# EAGLE design IOIO Sensors (EAGLE 5.11)
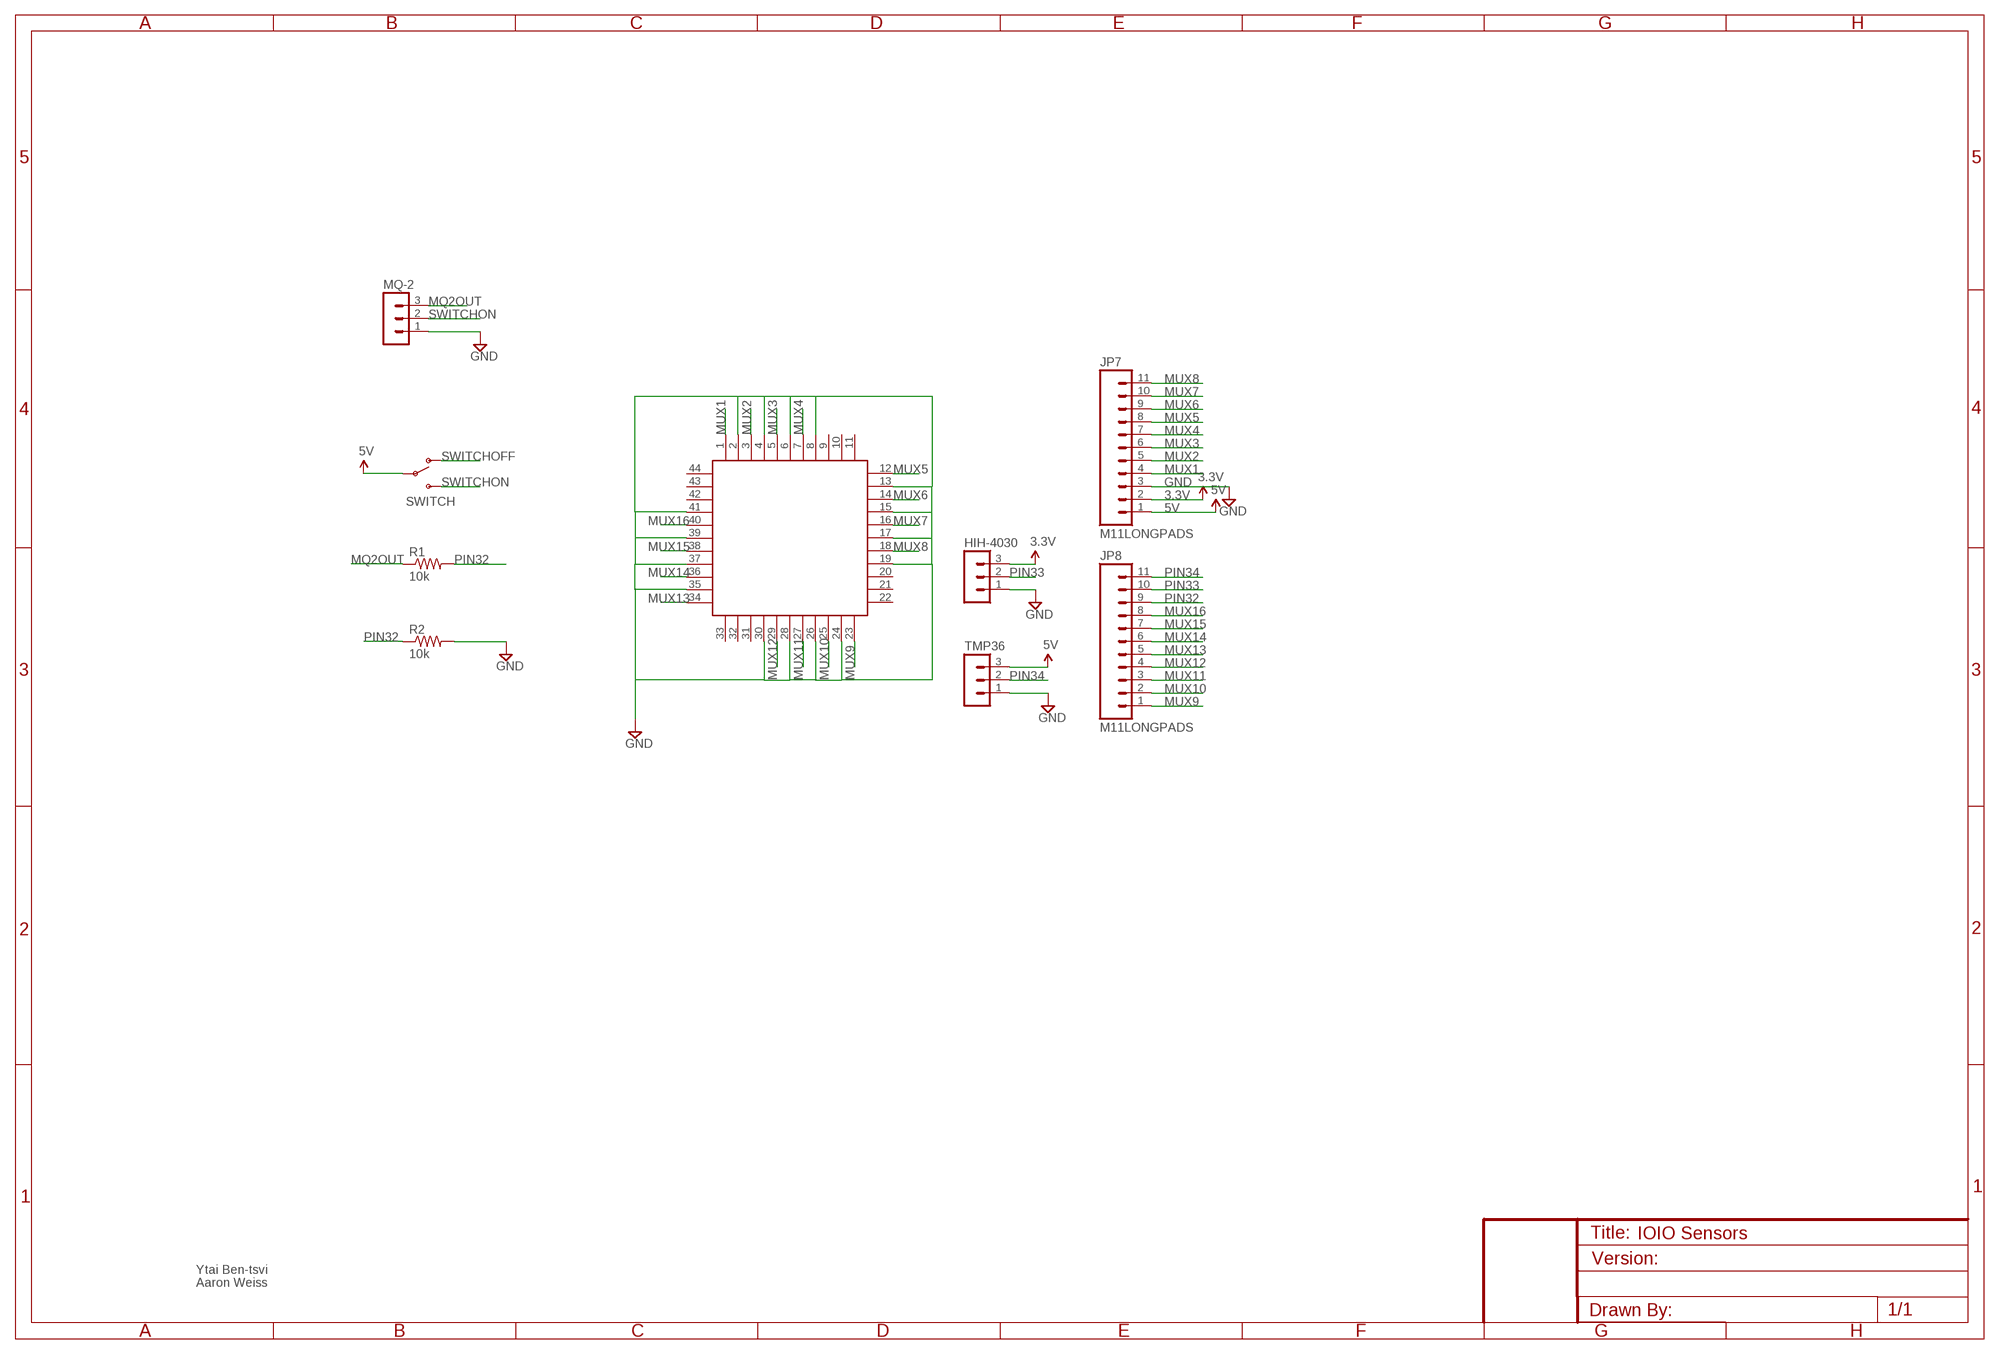
[diagram p0: schematic, sheet 1]

## Parts
HIH-4030  MA03-1  [MA03-1]
JP7  M11LONGPADS  [1X11_LONGPADS]
JP8  M11LONGPADS  [1X11_LONGPADS]
MQ-2  MA03-1  [MA03-1]
R1  10k  R-US_0207/7  [0207/7]
R2  10k  R-US_0207/7  [0207/7]
SWITCH  SWITCH-SPSTPTH_LOCK  [SWITCH-SPDT_LOCK.007S]
TMP36  MA03-1  [MA03-1]
U$4  S44  [S44]

## Nets
3.3V: HIH-4030.3 JP7.2
5V: JP7.1 SWITCH.2(P) TMP36.3
GND: HIH-4030.1 JP7.3 MQ-2.1 R2.2 TMP36.1 U$4.2 U$4.4 U$4.6 U$4.8 U$4.13 U$4.15 U$4.17 U$4.19 U$4.24 U$4.26 U$4.28 U$4.30 U$4.35 U$4.37 U$4.39 U$4.41
MQ2OUT: MQ-2.3 R1.1
MUX1: JP7.4 U$4.1
MUX2: JP7.5 U$4.3
MUX3: JP7.6 U$4.5
MUX4: JP7.7 U$4.7
MUX5: JP7.8 U$4.12
MUX6: JP7.9 U$4.14
MUX7: JP7.10 U$4.16
MUX8: JP7.11 U$4.18
MUX9: JP8.1 U$4.23
MUX10: JP8.2 U$4.25
MUX11: JP8.3 U$4.27
MUX12: JP8.4 U$4.29
MUX13: JP8.5 U$4.34
MUX14: JP8.6 U$4.36
MUX15: JP8.7 U$4.38
MUX16: JP8.8 U$4.40
PIN32: JP8.9 R1.2 R2.1
PIN33: HIH-4030.2 JP8.10
PIN34: JP8.11 TMP36.2
SWITCHOFF: SWITCH.1(O)
SWITCHON: MQ-2.2 SWITCH.3(S)
Unconnected: U$4.9 U$4.10 U$4.11 U$4.20 U$4.21 U$4.22 U$4.31 U$4.32 U$4.33 U$4.42 U$4.43 U$4.44

## Notes on the sheet
- Ytai Ben-tsvi
- Aaron Weiss

## Library data of the parts
HIH-4030 MQ-2 TMP36 = con-lstb:MA03-1: PIN HEADER; OC_FARNELL: unknown; OC_NEWARK: unknown
JP7 JP8 = SparkFun:M11: Header 11 Standard 11-pin 0.1" header. Use with straight break away headers (SKU : PRT-00116), right angle break away headers (PRT-00553), swiss pins (PRT-00743), machine pins (PRT-00117), and female headers (PRT-00115).
R1 R2 = resistor:R-US_: RESISTOR, American symbol
SWITCH = SparkFun:SWITCH-SPST: SPST Switch Simple slide switch. Spark Fun Electronics SKU : COM-00102
U$4 = plcc-socket:S44: 44-pin PLCC through-hole socket

## Board
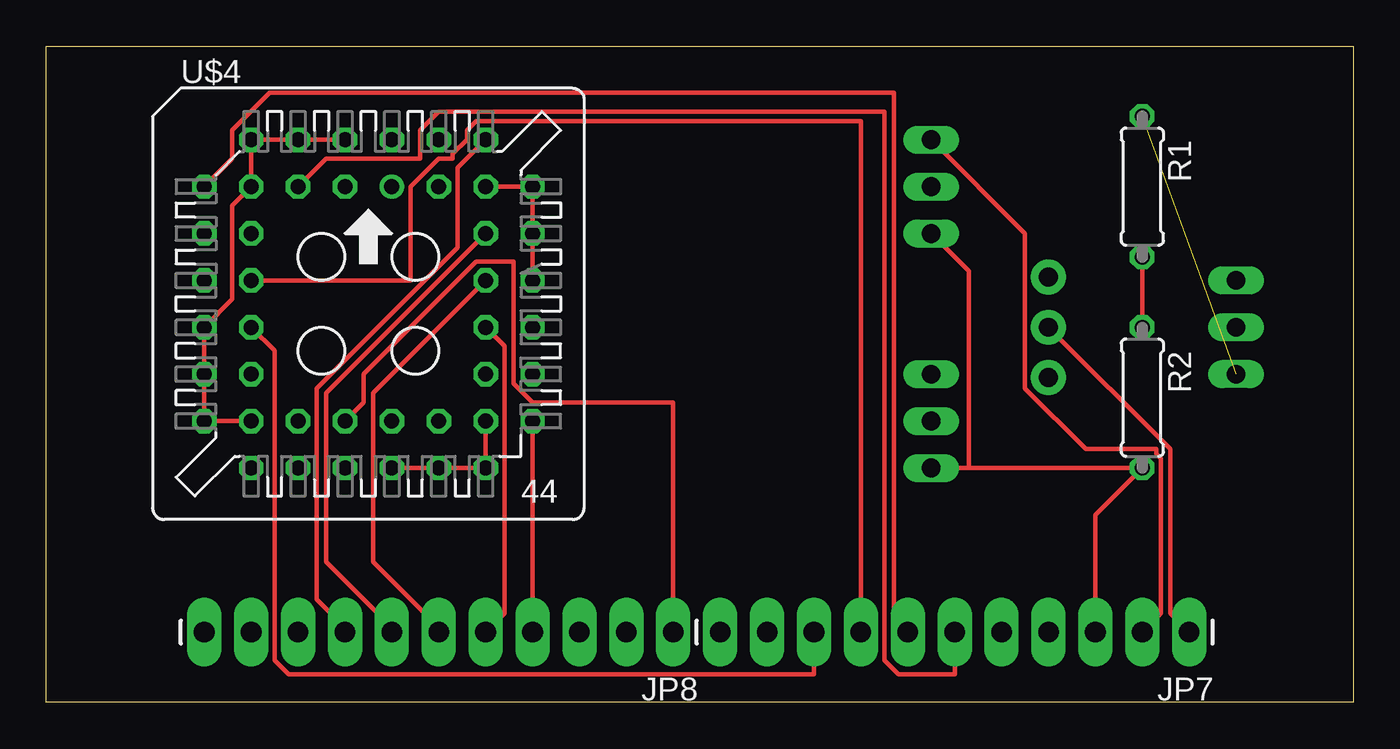
[diagram p1: board, top side]
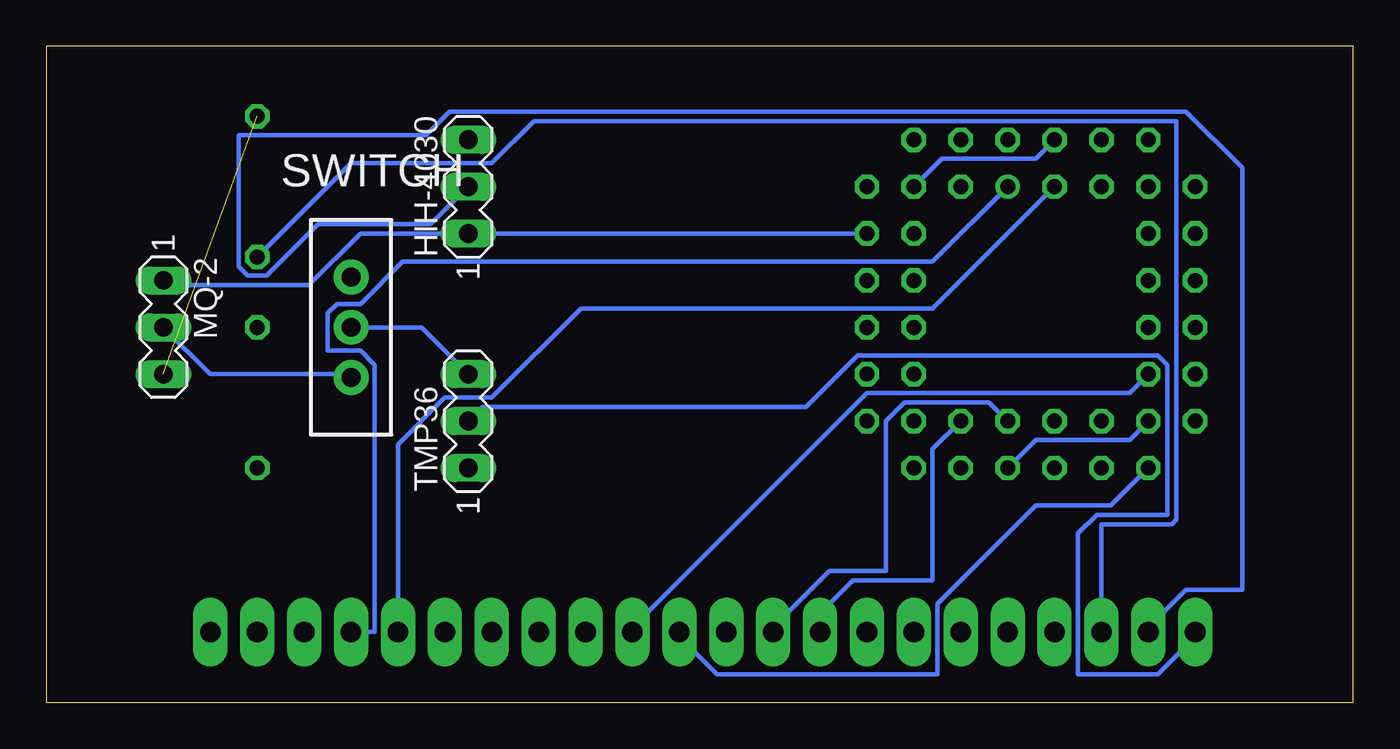
[diagram p2: board, bottom side, seen from below]

Size 70.79 x 35.55 mm. Coordinates in mm from the lower left corner, seen from the top.
Outline: 70.79,0 0,0 0,35.55 70.79,35.55 70.79,0
Copper layers (1*16): Top 0.035mm / dielectric 1.5mm / Bottom 0.035mm
Design rules "default": minimum track width 10mil, minimum drill 24mil, track to track 8mil, track to pad 8mil, pad to pad 8mil, via to via 8mil, smd to smd 8mil, copper to edge 40mil, drill to drill 8mil, minimum pad ring 10mil, minimum via ring 8mil, stop-mask expansion 4mil, vias tented up to drill 0mil, thermal gap 10mil

### Footprints (pad centres in the part's own frame; a part is rotated, then mirrored left to right if it is on the bottom)
MA03-1 = drill 1.016 long: 1 -2.54,0; 2 0,0; 3 2.54,0
1X11_LONGPADS = drill 1.118 pad 1.88 long: 1 0,0; 2 2.54,0; 3 5.08,0; 4 7.62,0; 5 10.16,0; 6 12.7,0; 7 15.24,0; 8 17.78,0; 9 20.32,0; 10 22.86,0; 11 25.4,0
0207/7 = drill 0.813 octagon: 1 -3.81,0; 2 3.81,0
SWITCH-SPDT_LOCK.007S = drill 1.016 pad 1.88 round: 1 0,2.718; 2 0,0; 3 0,-2.718
S44 = drill 0.813 round: 1 1.27,6.35 | drill 0.813 octagon: 2 -1.27,8.89; 3 -1.27,6.35; 4 -3.81,8.89; 5 -3.81,6.35; 6 -6.35,8.89; 7 -8.89,6.35; 8 -6.35,6.35; 9 -8.89,3.81; 10 -6.35,3.81; 11 -8.89,1.27; 12 -6.35,1.27; 13 -8.89,-1.27; 14 -6.35,-1.27; 15 -8.89,-3.81; 16 -6.35,-3.81; 17 -8.89,-6.35; 18 -6.35,-8.89; 19 -6.35,-6.35; 20 -3.81,-8.89; 21 -3.81,-6.35; 22 -1.27,-8.89; 23 -1.27,-6.35; 24 1.27,-8.89; 25 1.27,-6.35; 26 3.81,-8.89; 27 3.81,-6.35; 28 6.35,-8.89; 29 8.89,-6.35; 30 6.35,-6.35; 31 8.89,-3.81; 32 6.35,-3.81; 33 8.89,-1.27; 34 6.35,-1.27; 35 8.89,1.27; 36 6.35,1.27; 37 8.89,3.81; 38 6.35,3.81; 39 8.89,6.35; 40 6.35,8.89; 41 6.35,6.35; 42 3.81,8.89; 43 3.81,6.35; 44 1.27,8.89

### Placement (x,y rotation side)
HIH-4030  47.93,27.94 90 bottom
JP7  61.9,3.81 180 top
JP8  33.96,3.81 180 top
MQ-2  64.44,20.32 270 bottom
R1  59.36,27.94 270 top
R2  59.36,16.51 270 top
SWITCH  54.28,20.32 0 bottom
TMP36  47.93,15.24 90 bottom
U$4  17.45,21.59 0 top

### Tracks (layer width: path | path; a pad name or v marks a point on that pad's centre or on a via)
3.3V
  Top 0.254: HIH-4030.3 53.01,25.4 53.01,17.02 56.31,13.72 60.12,13.72 60.12,13.46 60.38,13.21 60.38,4.83 JP7.2
5V
  Top 0.254: JP7.1 60.88,4.83 60.88,13.72 SWITCH.2
  Bottom 0.254: TMP36.3 50.47,20.32 SWITCH.2
GND
  Top 0.254: U$4.24 U$4.26 U$4.28 U$4.30 | U$4.19 U$4.17 U$4.15 U$4.13 10.08,21.84 10.08,26.92 U$4.8 U$4.6 U$4.4 U$4.2 | U$4.35 U$4.37 U$4.39 U$4.41 | JP7.3 56.82,10.16 R2.2 49.96,12.7 | 49.96,12.7 TMP36.1 | HIH-4030.1 49.96,23.37 49.96,12.7
  Bottom 0.254: U$4.24 17.2,14.22 12.12,14.22 U$4.19 | U$4.41 22.28,29.46 17.2,29.46 U$4.2 | MQ-2.1 64.19,22.61 56.57,22.61 53.77,25.4 HIH-4030.1 U$4.37
MQ2OUT  (1 unrouted)
MUX1
  Bottom 0.254: U$4.1 22.78,23.88 51.49,23.88 53.77,21.59 55.04,21.59 55.55,21.08 55.55,19.05 53.77,19.05 53.01,18.29 53.01,3.81 JP7.4
MUX2
  Bottom 0.254: U$4.3 22.78,21.34 41.83,21.34 46.66,16.51 49.2,16.51 51.74,13.97 JP7.5
MUX3
  Top 0.254: U$4.5 15.16,29.46 20.24,29.46 20.24,30.99 21.26,32 45.39,32 45.39,2.29 46.15,1.52 49.2,1.52 JP7.6
MUX4
  Top 0.254: U$4.7 10.08,29.46 10.08,30.99 12.12,33.02 45.9,33.02 45.9,4.57 JP7.7
MUX5
  Top 0.254: U$4.12 19.74,22.86 19.74,27.94 21.26,29.46 22.02,29.46 22.02,29.72 22.78,30.48 22.78,30.99 23.29,31.5 44.12,31.5 JP7.8
MUX6
  Top 0.254: U$4.14 12.37,19.05 12.37,2.29 13.13,1.52 41.58,1.52 JP7.9
MUX7
  Bottom 0.254: U$4.16 12.12,16.76 26.34,16.76 39.04,4.06 JP7.10
MUX8
  Bottom 0.254: U$4.18 13.13,10.67 17.2,10.67 22.53,5.33 22.53,1.52 34.47,1.52 36.5,3.56 JP7.11
MUX9
  Top 0.254: U$4.23 17.2,16.26 17.2,17.78 23.29,23.88 25.32,23.88 25.32,17.27 26.34,16.26 33.96,16.26 JP8.1
MUX10
  Bottom 0.254: U$4.25 19.74,16.26 24.31,16.26 25.32,15.24 25.32,7.11 28.37,7.11 31.42,4.06 JP8.2
MUX11
  Bottom 0.254: U$4.27 22.78,13.72 22.78,6.6 27.1,6.6 28.88,4.83 JP8.3
MUX12
  Top 0.254: JP8.4 U$4.29
MUX13
  Top 0.254: U$4.34 24.82,19.3 24.82,4.83 JP8.5
MUX14
  Top 0.254: U$4.36 17.7,16.76 17.7,7.62 21.26,4.06 JP8.6
MUX15
  Top 0.254: U$4.38 15.16,16.76 15.16,7.62 18.72,4.06 JP8.7
MUX16
  Top 0.254: U$4.40 22.28,28.96 22.28,24.64 14.66,17.02 14.66,5.59 16.18,4.06 JP8.8
PIN32
  Top 0.254: R1.2 R2.1
  Bottom 0.254: JP8.9 13.64,9.65 9.83,9.65 9.58,9.91 9.58,31.5 44.37,31.5 46.66,29.21 54.28,29.21 R1.2
PIN33
  Bottom 0.254: HIH-4030.2 49.96,25.91 56.06,25.91 58.85,23.11 59.87,23.11 60.38,23.62 60.38,30.73 50.22,30.73 48.95,32 9.07,32 6.02,28.96 6.02,6.1 9.07,6.1 11.1,4.06 JP8.10
PIN34
  Bottom 0.254: TMP36.2 47.17,16 29.64,16 26.85,18.8 10.59,18.8 10.08,18.29 10.08,10.16 13.89,10.16 14.91,9.14 14.91,1.52 10.59,1.52 8.56,3.56 JP8.11
SWITCHON
  Bottom 0.254: MQ-2.2 61.9,17.78 54.28,17.78 SWITCH.3